# EAGLE schematic LCD (EAGLE 7.3.0)
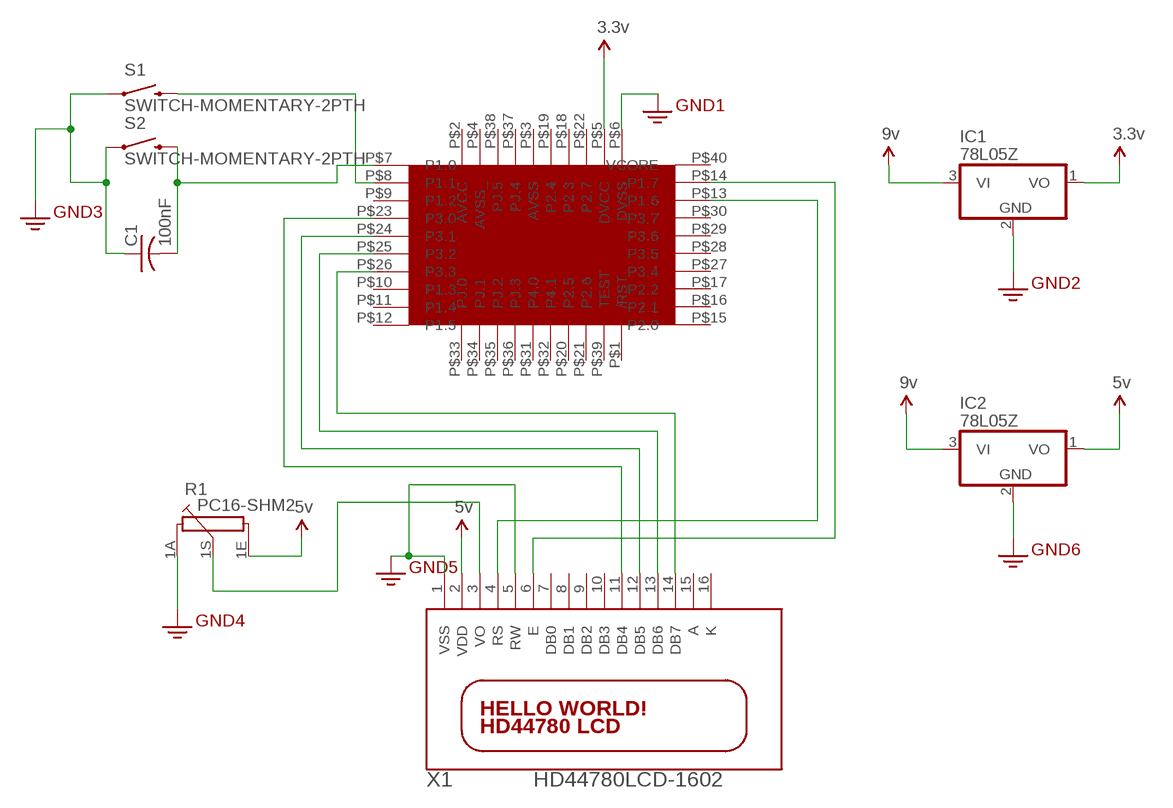
[diagram p0: schematic, sheet 1]

## Parts
C1  100nF  C-US025-024X044  [C025-024X044]
IC1  78L05Z  [TO92]
IC2  78L05Z  [TO92]
R1  PC16-SHM2  [PC16-SHM2]
S1  SWITCH-MOMENTARY-2PTH  [TACTILE-PTH]
S2  SWITCH-MOMENTARY-2PTH  [TACTILE-PTH]
U$1  MSP430FR5739  [40QFP]
X1  HD44780LCD-1602  [LCD1602]

## Nets
3.3V: C1.1 IC1.2(GND) IC2.2(GND) R1.1A S1.1 S2.1 U$1.P$6(DVSS) ; supply symbol labelled GND
N$1: U$1.P$23(P3.0) X1.11(DB4)
N$2: C1.2 S2.3 U$1.P$7(P1.0)
N$3: S1.3 U$1.P$8(P1.1)
N$4: R1.1S X1.3(VO)
N$5: U$1.P$13(P1.6) X1.4(RS)
N$6: U$1.P$14(P1.7) X1.6(E)
N$7: U$1.P$24(P3.1) X1.12(DB5)
N$8: U$1.P$25(P3.2) X1.13(DB6)
N$9: U$1.P$26(P3.3) X1.14(DB7)
VCC: IC1.1(VO) IC1.3(VI) IC2.1(VO) IC2.3(VI) R1.1E U$1.P$5(DVCC) ; supply symbol labelled 5v, 9v, 3.3v
VDD: X1.2(VDD) ; supply symbol labelled 5v
VSS: X1.1(VSS) X1.5(RW) ; supply symbol labelled GND
Unconnected: R1.M1 R1.M2 R1.M3 R1.M4 U$1.P$1(/RST) U$1.P$2(AVCC) U$1.P$3(AVSS) U$1.P$4(AVSS_) U$1.P$9(P1.2) U$1.P$10(P1.3) U$1.P$11(P1.4) U$1.P$12(P1.5) U$1.P$15(P2.0) U$1.P$16(P2.1) U$1.P$17(P2.2) U$1.P$18(P2.3) U$1.P$19(P2.4) U$1.P$20(P2.5) U$1.P$21(P2.6) U$1.P$22(P2.7) U$1.P$27(P3.4) U$1.P$28(P3.5) U$1.P$29(P3.6) U$1.P$30(P3.7) U$1.P$31(P4.0) U$1.P$32(P4.1) U$1.P$33(PJ.0) U$1.P$34(PJ.1) U$1.P$35(PJ.2) U$1.P$36(PJ.3) U$1.P$37(PJ.4) U$1.P$38(PJ.5) U$1.P$39(TEST) U$1.P$40(VCORE) X1.7(DB0) X1.8(DB1) X1.9(DB2) X1.10(DB3) X1.15(A) X1.16(K)

## Library data of the parts
C1 = adafruit:C-US: CAPACITOR, American symbol
IC1 IC2 = adafruit:78*: Positive VOLTAGE REGULATOR Added bigger pads to the TO-92 package
R1 = piher:PC16-SHM2: POTENTIOMETER single carbon potentiometer, 16 mm, S3ROH; OC_FARNELL: unknown; OC_NEWARK: unknown
S1 S2 = SparkFun-Electromechanical:SWITCH-MOMENTARY-2: Various NO switches- pushbuttons, reed, etc; PROD_ID: SWCH-08441
U$1 = max parts:MSP430FR5739
X1 = adafruit:HD44780LCD: HD44780 LCD Standard character type LCDs, available in sizes from 8x1 to 40x4!